# EAGLE design adruino robot rev (EAGLE 7.2.0)
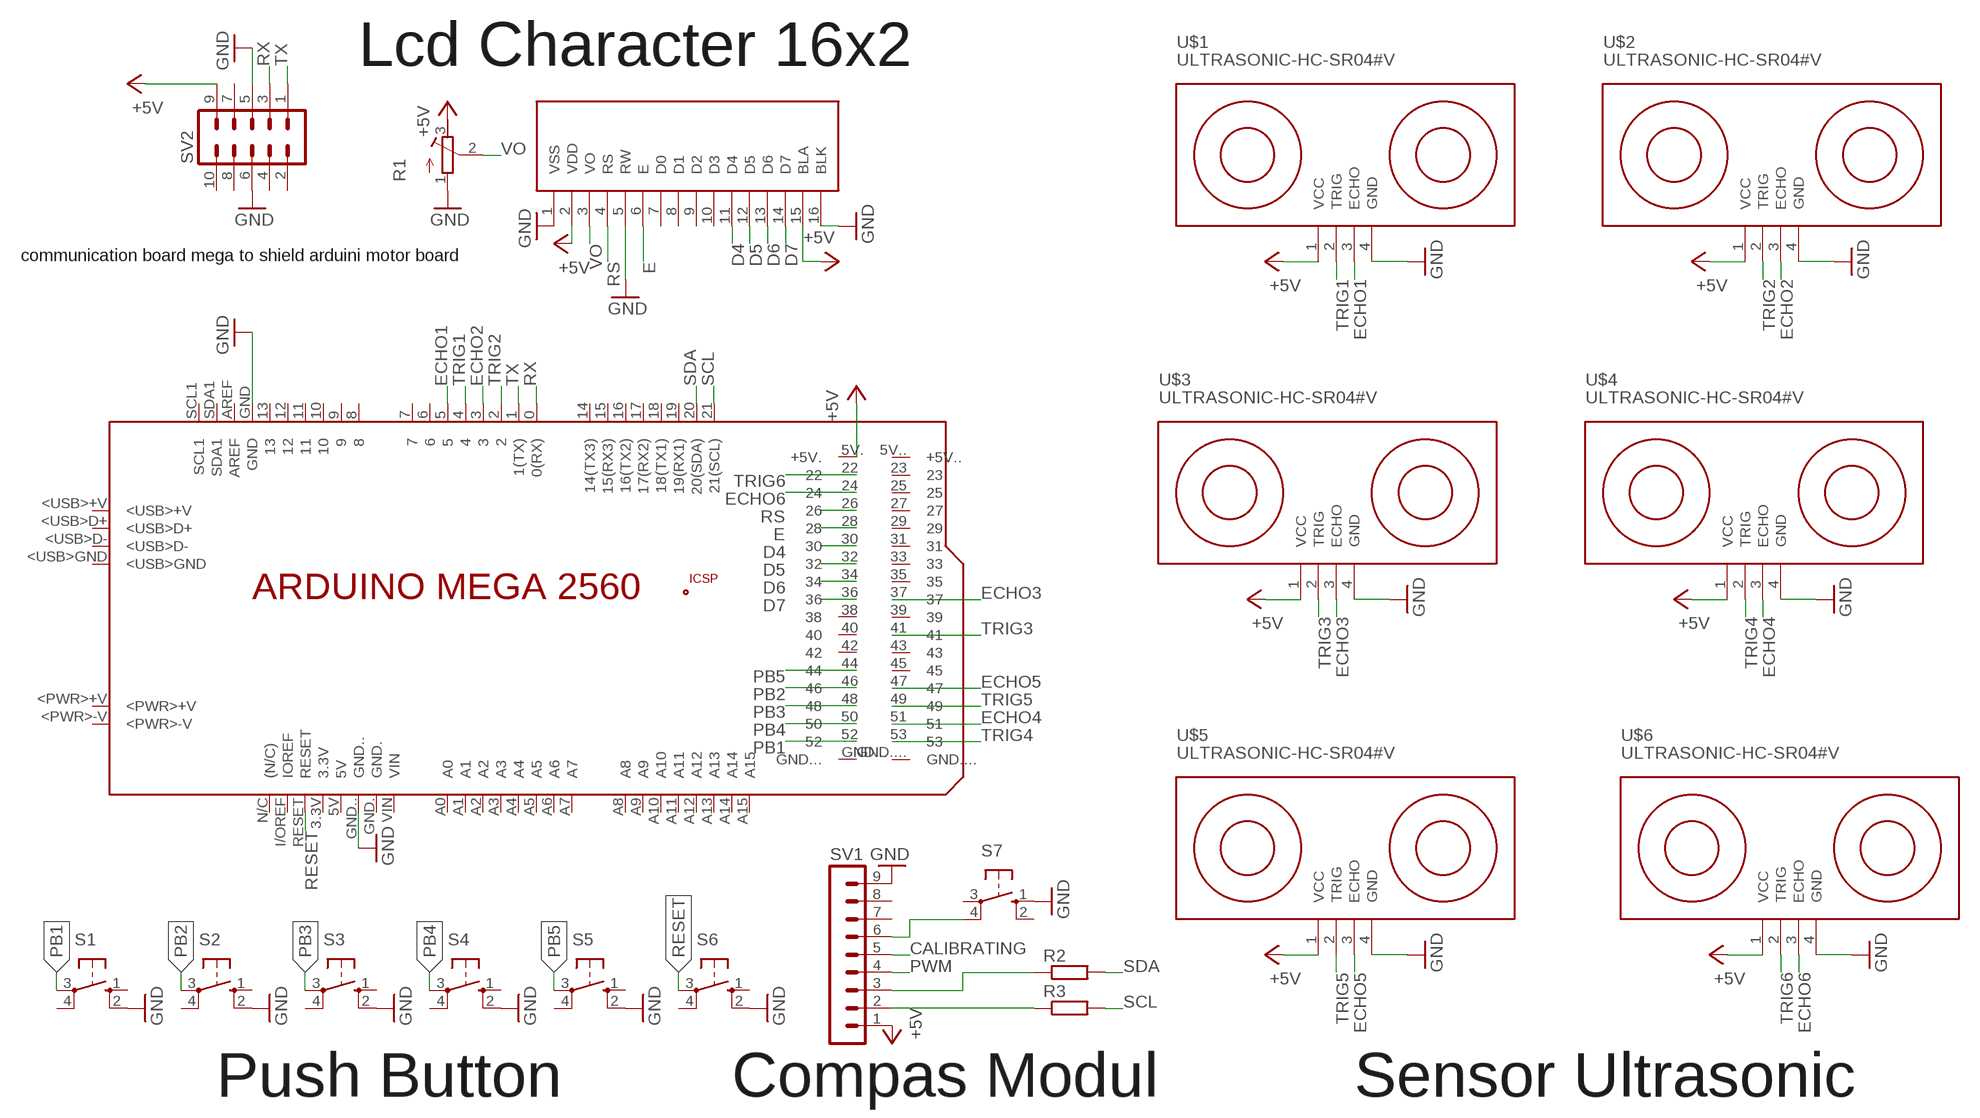
[diagram p0: schematic, sheet 1]

## Parts
PCB1  ARDUINO_MEGA2560  [ARDUINO_MEGA2560]
R1  R-TRIMM3339P  [RTRIM3339P]
R2  R-EU_0204/7  [0204/7]
R3  R-EU_0204/7  [0204/7]
S1  40-XX  [B3F-40XX]
S2  40-XX  [B3F-40XX]
S3  40-XX  [B3F-40XX]
S4  40-XX  [B3F-40XX]
S5  40-XX  [B3F-40XX]
S6  40-XX  [B3F-40XX]
S7  40-XX  [B3F-40XX]
SV1  MA09-1  [MA09-1]
SV2  ML10  [ML10]
U$1  ULTRASONIC-HC-SR04#V  [ULTRASONIC-HC-SR04#V]
U$2  ULTRASONIC-HC-SR04#V  [ULTRASONIC-HC-SR04#V]
U$3  ULTRASONIC-HC-SR04#V  [ULTRASONIC-HC-SR04#V]
U$4  ULTRASONIC-HC-SR04#V  [ULTRASONIC-HC-SR04#V]
U$5  ULTRASONIC-HC-SR04#V  [ULTRASONIC-HC-SR04#V]
U$6  ULTRASONIC-HC-SR04#V  [ULTRASONIC-HC-SR04#V]
U$7  2X16LCDTOP  [2X16LCDTOP]

## Nets
+5V: PCB1.5V.(+5V.) R1.3(E) SV1.1 SV2.9 U$1.1(VCC) U$2.1(VCC) U$3.1(VCC) U$4.1(VCC) U$5.1(VCC) U$6.1(VCC) U$7.2(VDD) U$7.15(BLA)
CALIBRATING: SV1.5
D4: PCB1.30 U$7.11(D4)
D5: PCB1.32 U$7.12(D5)
D6: PCB1.34 U$7.13(D6)
D7: PCB1.36 U$7.14(D7)
E: PCB1.28 U$7.6(E)
ECHO1: PCB1.5 U$1.3(ECHO)
ECHO2: PCB1.3 U$2.3(ECHO)
ECHO3: PCB1.37 U$3.3(ECHO)
ECHO4: PCB1.51 U$4.3(ECHO)
ECHO5: PCB1.47 U$5.3(ECHO)
ECHO6: PCB1.24 U$6.3(ECHO)
GND: PCB1.GND PCB1.GND.. R1.1(A) S1.2(S1) S2.2(S1) S3.2(S1) S4.2(S1) S5.2(S1) S6.2(S1) S7.1(S) SV1.9 SV2.5 SV2.6 U$1.4(GND) U$2.4(GND) U$3.4(GND) U$4.4(GND) U$5.4(GND) U$6.4(GND) U$7.1(VSS) U$7.5(RW) U$7.16(BLK)
N$2: R2.1 SV1.3
N$3: R3.1 SV1.2
N$7: S7.4(P1) SV1.6
PB1: PCB1.52 S1.3(P)
PB2: PCB1.46 S2.3(P)
PB3: PCB1.48 S3.3(P)
PB4: PCB1.50 S4.3(P)
PB5: PCB1.44 S5.3(P)
PWM: SV1.4
RESET: PCB1.RESET S6.3(P)
RS: PCB1.26 U$7.4(RS)
RX: PCB1.0(0(RX)) SV2.3
SCL: PCB1.21(21(SCL)) R3.2
SDA: PCB1.20(20(SDA)) R2.2
TRIG1: PCB1.4 U$1.2(TRIG)
TRIG2: PCB1.2 U$2.2(TRIG)
TRIG3: PCB1.41 U$3.2(TRIG)
TRIG4: PCB1.53 U$4.2(TRIG)
TRIG5: PCB1.49 U$5.2(TRIG)
TRIG6: PCB1.22 U$6.2(TRIG)
TX: PCB1.1(1(TX)) SV2.1
VO: R1.2(S) U$7.3(VO)
Unconnected: PCB1.3.3V PCB1.5V PCB1.5V..(+5V..) PCB1.6 PCB1.7 PCB1.8 PCB1.9 PCB1.10 PCB1.11 PCB1.12 PCB1.13 PCB1.14(14(TX3)) PCB1.15(15(RX3)) PCB1.16(16(TX2)) PCB1.17(17(RX2)) PCB1.18(18(TX1)) PCB1.19(19(RX1)) PCB1.23 PCB1.25 PCB1.27 PCB1.29 PCB1.31 PCB1.33 PCB1.35 PCB1.38 PCB1.39 PCB1.40 PCB1.42 PCB1.43 PCB1.45 PCB1.+5V_ PCB1.<PWR>+V PCB1.<PWR>-V PCB1.<USB>+V PCB1.<USB>D+ PCB1.<USB>D- PCB1.<USB>GND PCB1.A0 PCB1.A1 PCB1.A2 PCB1.A3 PCB1.A4 PCB1.A5 PCB1.A6 PCB1.A7 PCB1.A8 PCB1.A9 PCB1.A10 PCB1.A11 PCB1.A12 PCB1.A13 PCB1.A14 PCB1.A15 PCB1.AREF PCB1.GND. PCB1.GND... PCB1.GND.... PCB1.GND__ PCB1.I/OREF(IOREF) PCB1.MISO PCB1.MOSI PCB1.N/C((N/C)) PCB1.RESET. PCB1.SCK PCB1.SCL1 PCB1.SDA1 PCB1.VIN S1.1(S) S1.4(P1) S2.1(S) S2.4(P1) S3.1(S) S3.4(P1) S4.1(S) S4.4(P1) S5.1(S) S5.4(P1) S6.1(S) S6.4(P1) S7.2(S1) S7.3(P) SV1.7 SV1.8 SV2.2 SV2.4 SV2.7 SV2.8 SV2.10 U$7.7(D0) U$7.8(D1) U$7.9(D2) U$7.10(D3)

## Notes on the sheet
- Lcd Character 16x2
- communication board mega to shield arduini motor board
- Push Button | Compas Modul | Sensor Ultrasonic

## Library data of the parts
PCB1 = Arduino:ARDUINO_MEGA2560: Device for representing an Arduino Mega 2560 board with a footprint in an EAGLE design. Created by Dave Young for Element14. More EAGLE documentation at: http://www.element14.com/community/community/knode/cadsoft_eagle
R1 = resistor:R-TRIMM: Trimm resistor
R2 R3 = resistor:R-EU_: RESISTOR, European symbol
S1-S7 = switch-omron:40-XX: OMRON SWITCH; MF: OMRON COMPONENTS USA; MPN: B3F-4000; OC_FARNELL: 176434; OC_NEWARK: 36K3105
SV1 = con-lstb:MA09-1: PIN HEADER; OC_FARNELL: unknown; OC_NEWARK: unknown
SV2 = con-harting-ml:ML10: HARTING; OC_FARNELL: unknown; OC_NEWARK: unknown
U$1-U$6 = diy-modules:ULTRASONIC-HC-SR04: Ultrasonic Ranging Module HC-SR04 More details available here: http://randomnerdtutorials.com/complete-guide-for-ultrasonic-sensor-hc-sr04/ Click here to find device on ebay.com <http://www.ebay.com/sch/hc+sr04+ultrasonic>
U$7 = lcd_modules_ece:2X16LCDTOP

## Board
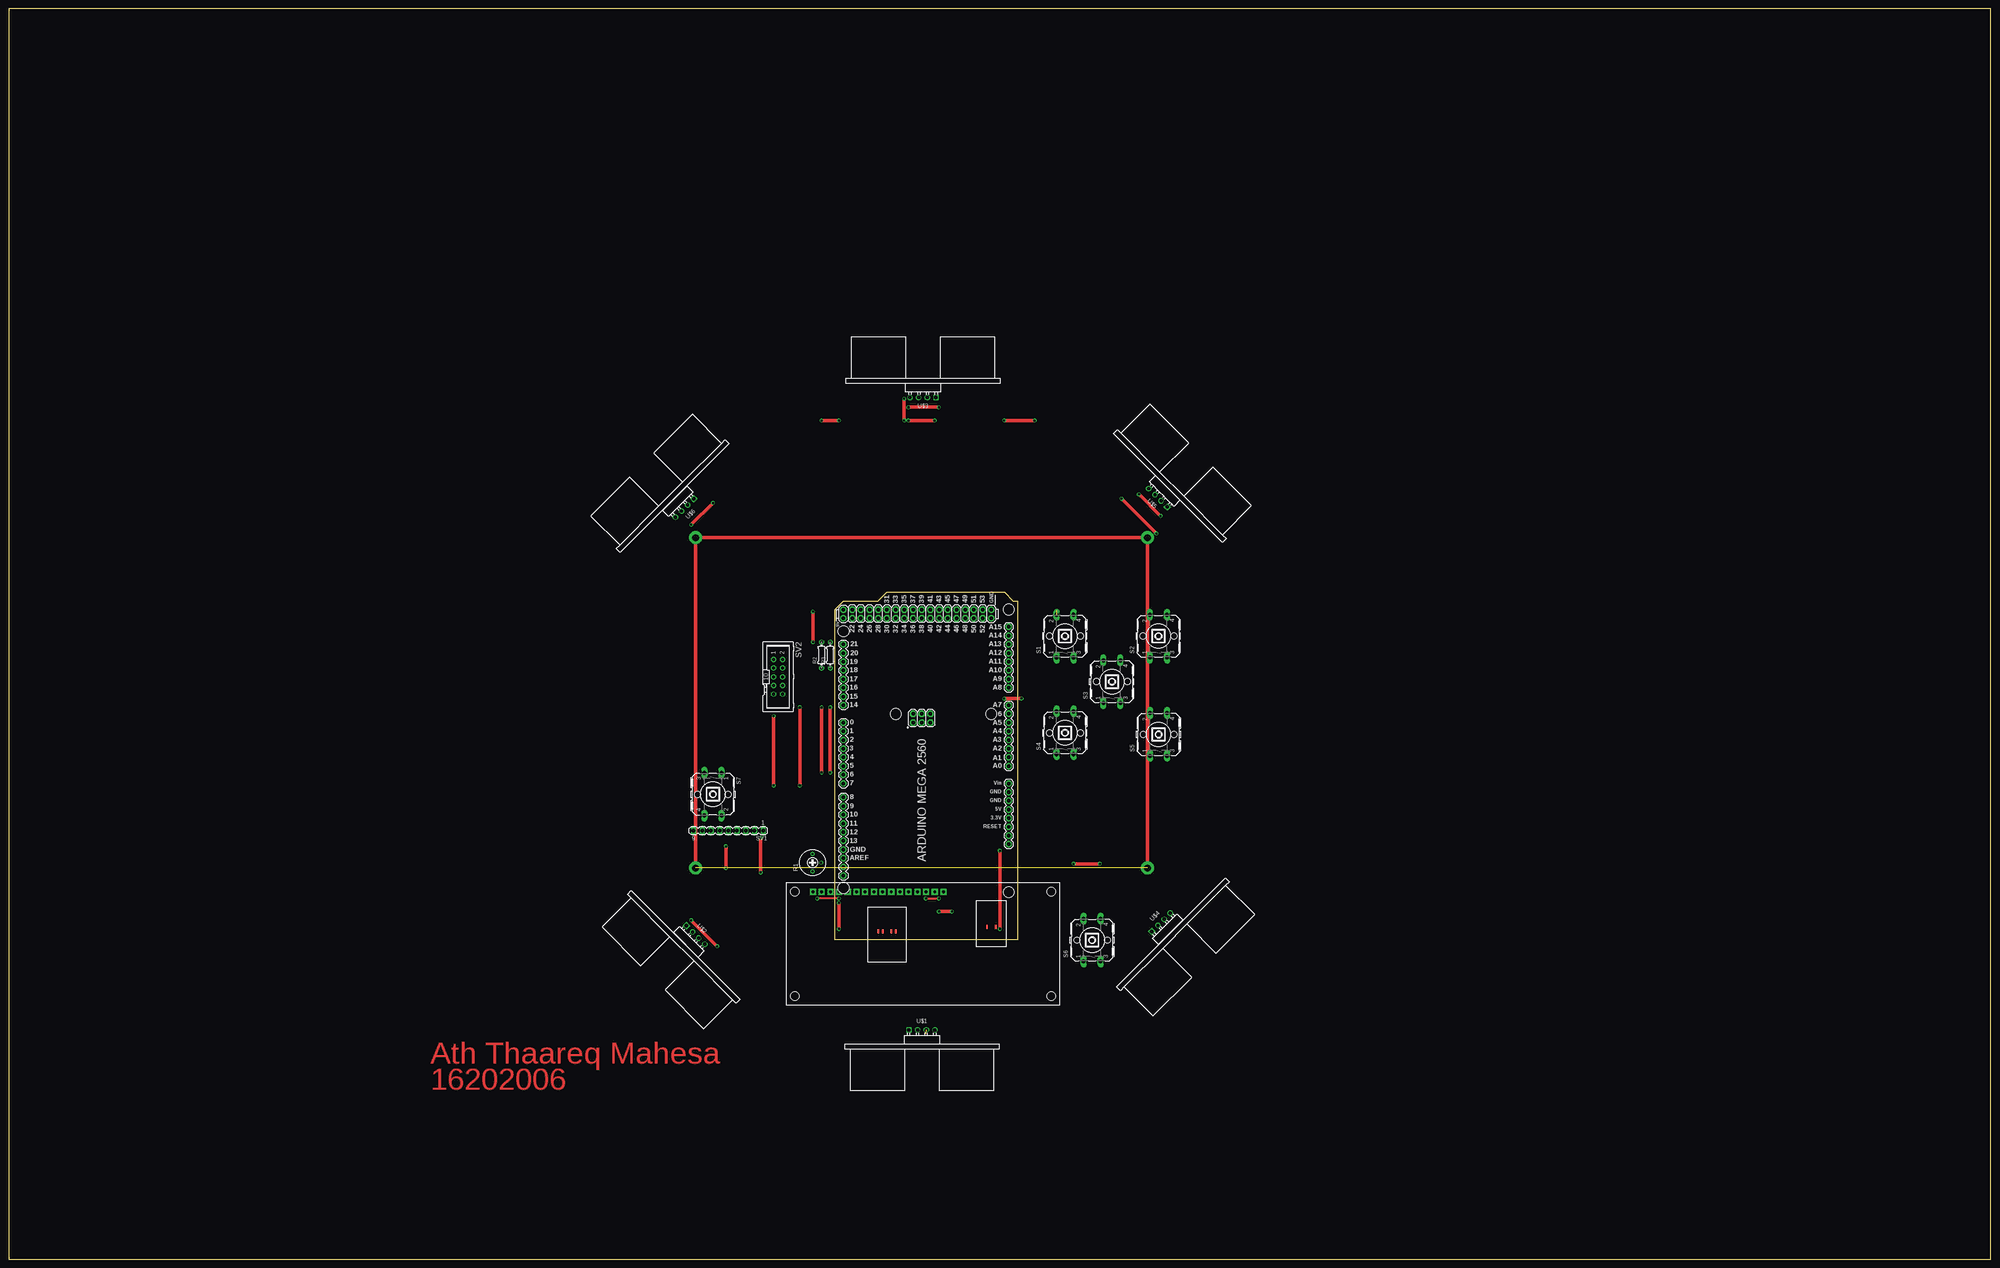
[diagram p1: board, top side]
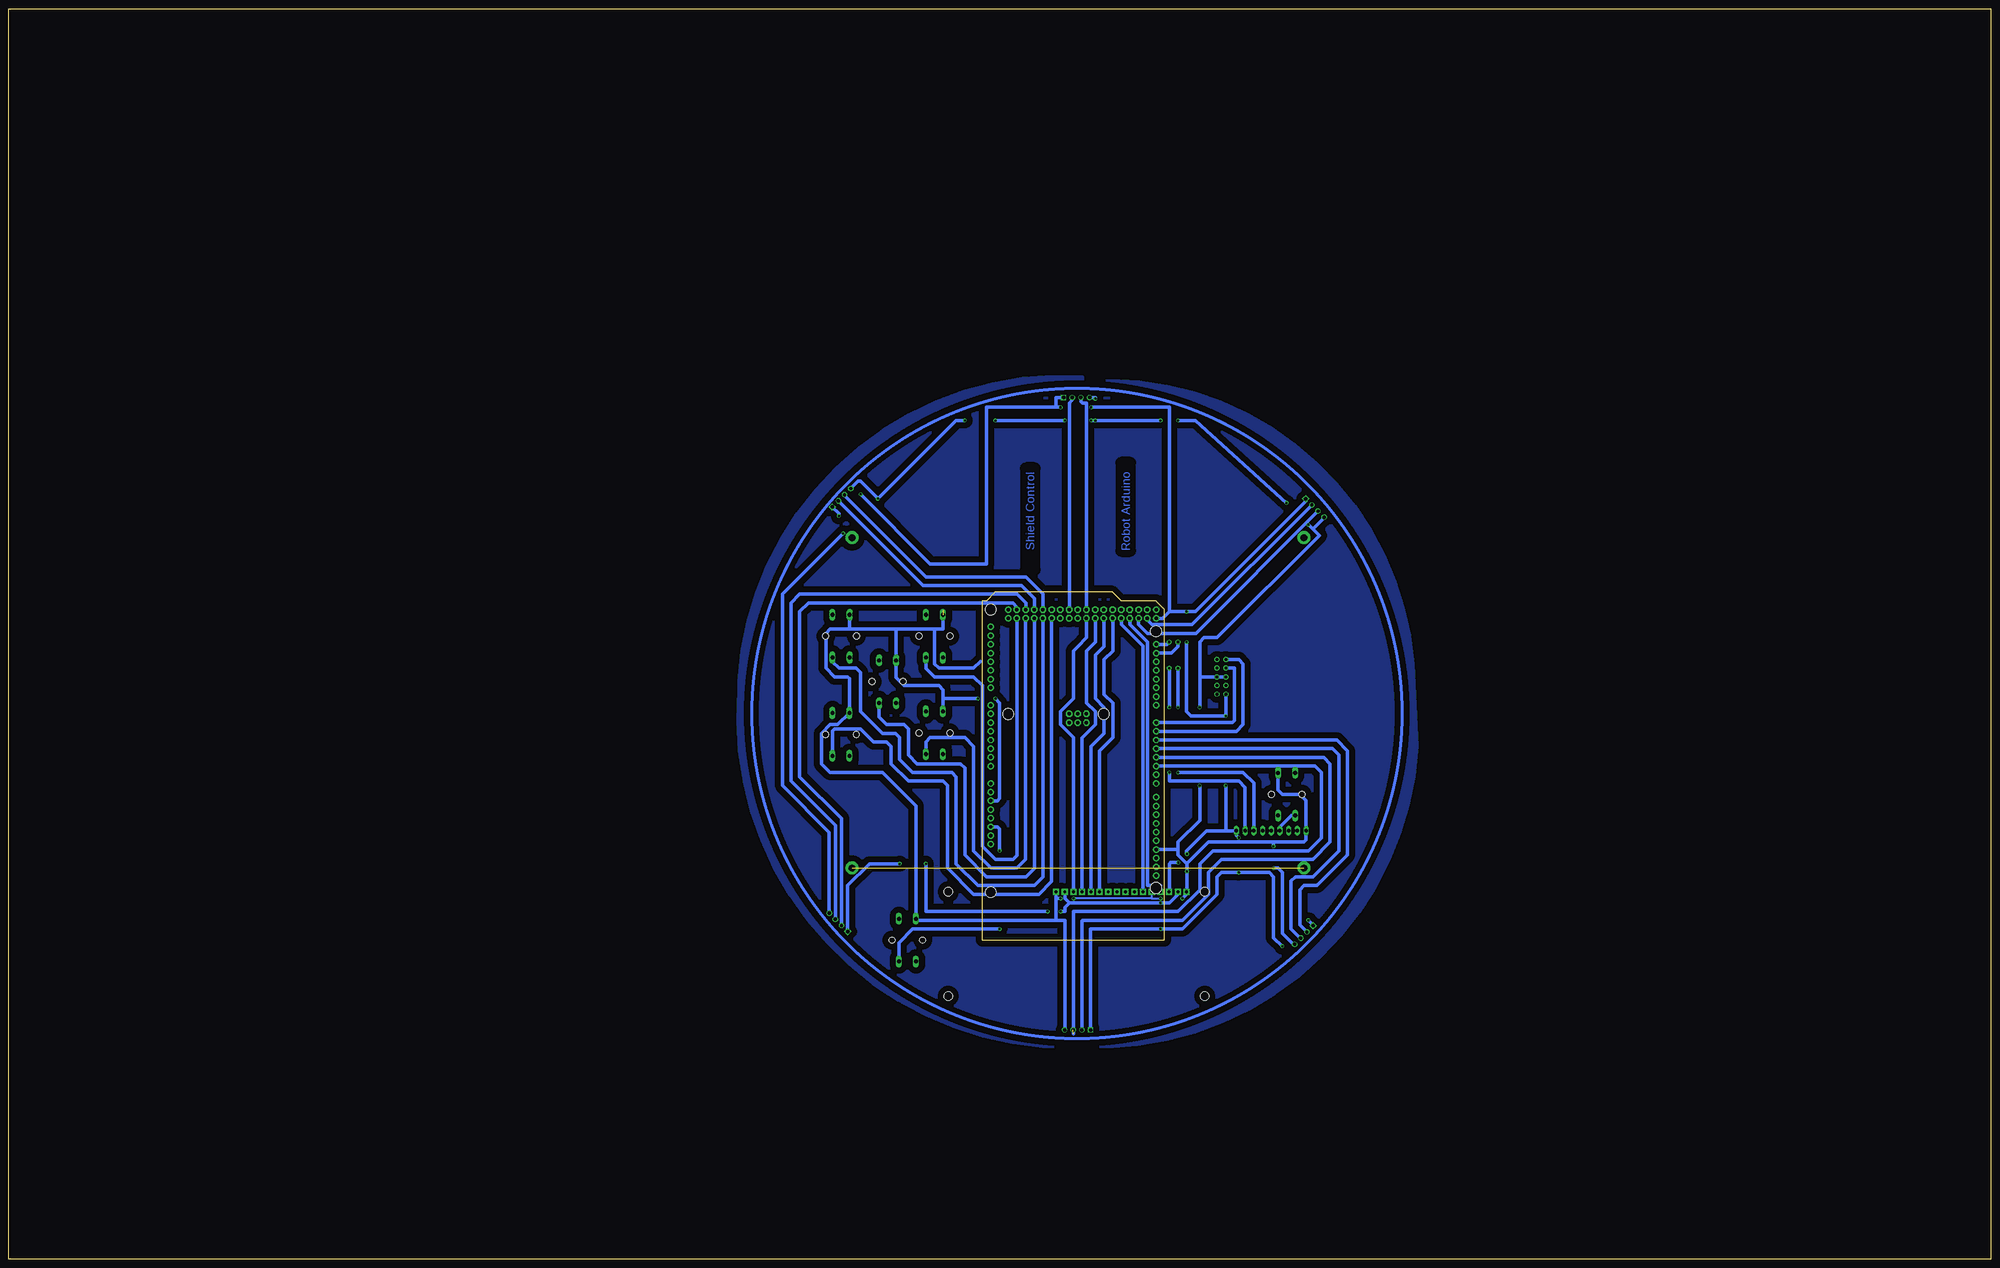
[diagram p2: board, bottom side, seen from below]

Size 579.1 x 365.43 mm. Coordinates in mm from the lower left corner, seen from the top.
Outline: 0,0 579.1,0 579.1,365.43 0,365.43 0,0
Copper layers (1*16): Top 0.035mm / dielectric 1.5mm / Bottom 0.035mm
Design rules "default": minimum track width 10mil, minimum drill 24mil, track to track 8mil, track to pad 8mil, pad to pad 8mil, via to via 8mil, smd to smd 8mil, copper to edge 40mil, drill to drill 8mil, minimum pad ring 10mil, minimum via ring 8mil, stop-mask expansion 4mil, vias tented up to drill 0mil, thermal gap 10mil

### Footprints (pad centres in the part's own frame; a part is rotated, then mirrored left to right if it is on the bottom)
ARDUINO_MEGA2560 = drill 1.016 pad 1.88: 0 63.5,50.8; 1 60.96,50.8; 2 58.42,50.8; 3 55.88,50.8; 3.3V 35.56,2.54; 4 53.34,50.8; 5 50.8,50.8; 5V 38.1,2.54; 5V. 93.98,50.8; 5V.. 96.52,50.8; 6 48.26,50.8; 7 45.72,50.8; 8 41.656,50.8; 9 39.116,50.8; 10 36.576,50.8; 11 34.036,50.8; 12 31.496,50.8; 13 28.956,50.8; 14 68.58,50.8; 15 71.12,50.8; 16 73.66,50.8; 17 76.2,50.8; 18 78.74,50.8; 19 81.28,50.8; 20 83.82,50.8; 21 86.36,50.8; A0 50.8,2.54; A1 53.34,2.54; A2 55.88,2.54; A3 58.42,2.54; A4 60.96,2.54; A5 63.5,2.54; A6 66.04,2.54; A7 68.58,2.54; A8 73.66,2.54; A9 76.2,2.54; A10 78.74,2.54; A11 81.28,2.54; A12 83.82,2.54; A13 86.36,2.54; A14 88.9,2.54; A15 91.44,2.54; AREF 23.876,50.8; GND 26.416,50.8; GND. 43.18,2.54; GND.. 40.64,2.54; GND... 93.98,7.62; GND.... 96.52,7.62; I/OREF 30.48,2.54; N/C 27.94,2.54; RESET 33.02,2.54; SCL1 18.796,50.8; SDA1 21.336,50.8; VIN 45.72,2.54 | drill 1.016 pad 1.88 octagon: 22 93.98,48.26; 23 96.52,48.26; 24 93.98,45.72; 25 96.52,45.72; 26 93.98,43.18; 27 96.52,43.18; 28 93.98,40.64; 29 96.52,40.64; 30 93.98,38.1; 31 96.52,38.1; 32 93.98,35.56; 33 96.52,35.56; 34 93.98,33.02; 35 96.52,33.02; 36 93.98,30.48; 37 96.52,30.48; 38 93.98,27.94; 39 96.52,27.94; 40 93.98,25.4; 41 96.52,25.4; 42 93.98,22.86; 43 96.52,22.86; 44 93.98,20.32; 45 96.52,20.32; 46 93.98,17.78; 47 96.52,17.78; 48 93.98,15.24; 49 96.52,15.24; 50 93.98,12.7; 51 96.52,12.7; 52 93.98,10.16; 53 96.52,10.16; +5V_ 66.04,30.48; GND__ 66.04,25.4; MISO 63.5,30.48; MOSI 66.04,27.94; RESET. 63.5,25.4; SCK 63.5,27.94 | smd 1.016 x 0.508: <PWR>+V 3.81,8.89; <PWR>-V 3.81,6.35; <USB>+V 2.54,40.64; <USB>D+ 2.54,39.37; <USB>D- 2.54,36.83; <USB>GND 2.54,35.56 | hole 3.2: 15.24,50.8; 13.97,2.54; 66.04,35.56; 66.04,7.62; 90.17,50.8; 96.52,2.54
RTRIM3339P = drill 0.61: 1 -2.54,0; 2 0,-2.54; 3 2.54,0
0204/7 = drill 0.813 octagon: 1 -3.81,0; 2 3.81,0
B3F-40XX = drill 1.194 long: 1 -6.248,2.489; 2 6.248,2.489; 3 -6.248,-2.489; 4 6.248,-2.489 | hole 1.803: 0,-4.496; 0,4.496
MA09-1 = drill 1.016 long: 1 -10.16,0; 2 -7.62,0; 3 -5.08,0; 4 -2.54,0; 5 0,0; 6 2.54,0; 7 5.08,0; 8 7.62,0; 9 10.16,0
ML10 = drill 0.914 octagon: 1 -5.08,-1.27; 2 -5.08,1.27; 3 -2.54,-1.27; 4 -2.54,1.27; 5 0,-1.27; 6 0,1.27; 7 2.54,-1.27; 8 2.54,1.27; 9 5.08,-1.27; 10 5.08,1.27
ULTRASONIC-HC-SR04#V = drill 1 square: 1 -3.81,0 | drill 1: 2 -1.27,0; 3 1.27,0; 4 3.81,0
2X16LCDTOP = drill 0.85 pad 1.778 square: 1 7.87,33.02; 2 10.41,33.02; 3 12.95,33.02; 4 15.49,33.02; 5 18.03,33.02; 6 20.57,33.02; 7 23.11,33.02; 8 25.65,33.02; 9 28.19,33.02; 10 30.73,33.02; 11 33.27,33.02; 12 35.81,33.02; 13 38.35,33.02; 14 40.89,33.02; 15 43.43,33.02; 16 45.97,33.02 | hole 2.54: 2.54,33.02; 77.47,33.02; 77.47,2.54; 2.54,2.54

### Placement (x,y rotation side)
PCB1  294.7,93.31 90 top
R1  234.87,115.89 90 top
R2  237.49,176.53 90 top
R3  240.03,176.53 90 top
S1  308.61,182.06 90 top
S2  335.91,182.07 90 top
S3  322.31,168.76 90 top
S4  308.62,153.84 90 top
S5  335.96,153.36 90 top
S6  316.54,93.25 90 top
S7  205.74,135.89 270 top
SV1  210.25,125.21 180 top
SV2  224.79,170.18 270 top
U$1  266.82,67.01 0 top
U$2  200.71,94.76 315 top
U$3  267.11,251.81 180 top
U$4  336.67,98.43 45 top
U$5  335.78,222.5 135 top
U$6  197.46,219.51 225 top
U$7  227.14,74.35 0 top

### Tracks (layer width: path | path; a pad name or v marks a point on that pad's centre or on a via)
+5V  (via drill 0.6)
  Top 1.016: v199.39,99.06 v207.01,91.44 | v219.71,113.03 v219.71,123.19 | v262.89,248.92 v271.78,248.92 | v330.2,223.52 v336.55,217.17 | v318.77,115.57 v311.15,115.57 | v275.59,101.6 v271.78,101.6 | v223.52,158.75 v223.52,138.43 | v242.57,96.52 v242.57,104.14 | v234.95,180.34 v234.95,189.23
  Bottom 1.016: U$7.15 270.56,105.47 269.24,104.14 | 269.24,104.14 v242.57,104.14 240.03,104.14 237.49,106.68 237.49,107.32 U$7.2 | R1.3 234.95,118.52 234.95,119.38 229.12,125.21 223.52,125.21 | U$2.1 198.01,97.68 v199.39,99.06 | v207.01,91.44 209.55,93.98 209.55,111.76 210.82,113.03 v219.71,113.03 224.79,113.03 226.06,111.76 226.06,106.68 236.22,96.52 v242.57,96.52 263.01,96.52 U$1.1 | U$6.1 200.16,221.48 232.41,189.23 v234.95,189.23 240.03,189.23 | 240.03,189.23 240.03,248.92 v262.89,248.92 | v271.78,248.92 273.05,248.92 | 273.05,248.92 293.37,248.92 293.37,203.2 309.88,203.2 v330.2,223.52 | v336.55,217.17 336.55,217.88 U$5.1 | v311.15,115.57 311.15,101.6 v275.59,101.6 | v271.78,101.6 270.51,101.6 270.51,102.87 269.24,104.14 | 223.52,125.21 SV1.1 220.41,123.9 v219.71,123.19 | PCB1.5V. 241.97,187.29 240.03,189.23 | v223.52,138.43 223.52,125.21 | SV2.9 v223.52,158.75 233.68,158.75 234.95,160.02 v234.95,180.34 | U$4.1 333.98,109.25 327.66,115.57 v318.77,115.57 | U$3.1 273.05,251.81 273.05,248.92
D4
  Bottom 1.016: U$7.11 260.4,148.54 256.54,152.4 256.54,162.56 259.08,165.1 259.08,175.26 256.54,177.8 256.54,187.23 PCB1.30
D5
  Bottom 1.016: U$7.12 262.94,149.81 259.08,153.67 259.08,161.29 261.62,163.83 261.62,176.53 259.08,179.07 259.08,187.23 PCB1.32
D6
  Bottom 1.016: U$7.13 265.49,152.34 261.62,156.21 261.62,160.02 264.16,162.56 264.16,177.8 261.62,180.34 261.62,187.23 PCB1.34
D7
  Bottom 1.016: U$7.14 268.02,152.45 271.78,156.21 271.78,160.02 267.97,163.83 267.97,177.8 266.7,179.07 264.16,181.61 264.16,187.23 PCB1.36
E
  Bottom 1.016: PCB1.28 254.06,185.48 247.7,179.12 U$7.6
ECHO1  (1 unrouted)
  Bottom 1.016: 267.97,65.86 267.97,101.6 237.49,101.6 231.14,107.95 231.14,115.57 227.33,119.38 199.39,119.38 195.58,123.19 195.58,142.24 197.45,144.11 PCB1.5
ECHO2
  Bottom 1.016: U$2.3 201.81,93.86 204.47,96.52 204.47,110.49 203.2,111.76 198.12,111.76 190.5,119.38 190.5,147.32 192.37,149.19 PCB1.3
ECHO3
  Bottom 1.016: PCB1.37 264.22,250.19 265.43,250.19 265.84,250.6 U$3.3
ECHO4
  Bottom 1.016: U$4.3 337.57,126.75 350.52,139.7 350.52,191.77 347.98,194.31 284.48,194.31 281.94,191.77 281.94,189.9 PCB1.51
ECHO5
  Bottom 1.016: U$5.3 334.88,223.12 311.15,199.39 281.94,199.39 276.92,194.37 PCB1.47
ECHO6
  Bottom 1.016: U$6.3 232.3,182.88 246.38,182.88 248.98,185.48 PCB1.24
GND  (via drill 0.6)  (1 unrouted)
  Top 0.61: v267.97,105.41 v271.78,105.41 | v242.57,105.41 v236.22,105.41
  Top 1.016: v335.28,212.09 v325.12,222.25 | v299.72,245.11 v290.83,245.11 | v270.51,245.11 v262.89,245.11 | v242.57,245.11 v237.49,245.11 | v261.62,251.46 v261.62,245.11 | v209.55,114.3 v209.55,120.65 | v205.74,220.98 v199.39,214.63 | v231.14,161.29 v231.14,138.43 | v290.83,163.83 v295.91,163.83
  Bottom 0.61: 245.11,105.41 v267.97,105.41 | U$7.5 245.16,105.47 245.11,105.41 | 245.11,105.41 v242.57,105.41 | 234.95,107.32 U$7.1
  Bottom 1.016: 333.43,184.15 339.09,184.15 340.36,182.88 340.36,172.72 337.82,170.18 334.01,170.18 333.47,169.64 S5.2 336.87,156.21 339.09,156.21 341.63,153.67 341.63,144.78 339.09,142.24 323.85,142.24 314.05,132.44 S6.2 314.05,99.06 273.05,99.06 | 333.43,184.15 S2.2 | 333.43,184.15 320.04,184.15 | 320.04,184.15 308.61,184.15 | 320.04,184.15 319.82,183.93 S3.2 319.82,169.96 317.5,167.64 307.34,167.64 306.07,166.37 306.07,163.83 | 308.61,184.15 308.61,173.99 307.34,172.72 297.18,172.72 295.24,174.66 | U$7.1 234.87,107.51 R1.1 234.87,115.65 | 306.07,163.83 306.07,160.14 S4.2 | 234.87,115.65 228.6,121.92 209.55,121.92 | U$5.4 330.95,227.33 330.2,227.33 v325.12,222.25 302.26,245.11 v299.72,245.11 | v290.83,245.11 v270.51,245.11 | v262.89,245.11 v261.62,245.11 v242.57,245.11 | U$3.4 261.62,251.81 v261.62,251.46 | v237.49,245.11 232.41,245.11 v205.74,220.98 | U$2.4 203.82,92.06 207.01,95.25 207.01,113.03 208.28,114.3 v209.55,114.3 | v209.55,120.65 209.55,121.92 | 234.95,107.32 234.95,106.68 v236.22,105.41 | 209.55,121.92 200.66,121.92 200.09,122.49 SV1.9 200.09,134.06 201.93,135.89 207.01,135.89 208.23,137.11 S7.1 | U$4.4 339.37,124.74 353.06,138.43 353.06,194.31 v335.28,212.09 | 231.14,170.18 231.14,180.34 229.87,181.61 226.06,181.61 196.21,211.46 198.12,213.36 | 231.14,170.18 v231.14,161.29 | v231.14,138.43 231.14,128.27 237.49,121.92 237.49,119.38 | PCB1.GND 237.84,119.73 237.49,119.38 | 234.87,115.65 235.03,115.65 237.49,118.11 237.49,119.38 | 306.07,189.52 306.07,184.15 308.61,184.15 | PCB1.GND.. 290.23,133.95 289.56,134.62 289.56,162.56 v290.83,163.83 | v295.91,163.83 306.07,163.83
  Bottom 1.016: SV2.5 SV2.6 231.14,170.18 | 198.12,213.36 v199.39,214.63 | 198.12,213.36 194.77,216.71 U$6.4 | U$1.4 270.51,67.01 270.51,99.06 273.05,99.06 | U$7.16 273.05,107.38 273.05,105.41 | 273.05,105.41 273.05,99.06 | v271.78,105.41 273.05,105.41
N$1
  pour Bottom (isolate 1.778): 167.64,149.86 168.91,173.99 arc-90 265.43,256.54 265.43,257.81 arc-90 365.76,168.91 365.76,166.37 arc-90 276.86,62.23 266.7,62.23 arc-90
N$2  (via drill 0.6)
  Top 1.016: v237.49,161.29 v237.49,142.24
  Bottom 1.016: R2.1 v237.49,161.29 | v237.49,142.24 218.44,142.24 215.33,139.13 SV1.3
N$3  (via drill 0.6)
  Top 1.016: v240.03,161.29 v240.03,142.24
  Bottom 1.016: R3.1 v240.03,161.29 | v240.03,142.24 240.03,139.7 219.71,139.7 217.88,137.87 SV1.2
N$4  (1 unrouted)
  Top 1.016: 200.66,114.43 200.66,210.69 | 332.74,114.43 332.74,210.69
N$5  (via drill 2 pad 3.81)
  other vias: 200.66,114.3
N$6  (via drill 2 pad 3.81)
  other vias: 332.74,114.3
N$7
  Bottom 1.016: SV1.6 207.71,126.3 204.37,129.64 S7.4
N$8  (via drill 2 pad 3.81)
  Top 1.016: v332.74,210.82 v200.66,210.82
PB1
  Bottom 1.016: S1.3 311.1,172.67 308.61,170.18 297.18,170.18 294.64,167.64 294.64,120.65 290.83,116.84 285.75,116.84 284.54,118.05 PCB1.52
PB2
  Bottom 1.016: S2.3 338.4,174.57 336.55,172.72 331.47,172.72 330.2,171.45 330.2,160.02 323.85,153.67 320.04,153.67 318.77,152.4 318.77,146.05 314.96,142.24 303.53,142.24 302.26,140.97 302.26,115.57 295.91,109.22 279.4,109.22 276.92,111.7 PCB1.46
PB3
  Bottom 1.016: S3.3 324.8,158.43 322.58,156.21 317.5,156.21 316.23,154.94 316.23,147.32 313.69,144.78 300.99,144.78 299.72,143.51 299.72,118.11 293.37,111.76 281.94,111.76 279.46,114.24 PCB1.48
PB4
  Bottom 1.016: S4.3 311.11,151.18 309.88,152.4 299.72,152.4 297.18,149.86 297.18,119.38 292.1,114.3 284.48,114.3 282,116.78 PCB1.50
PB5
  Bottom 1.016: S5.3 338.45,154.31 337.82,154.94 330.2,154.94 326.39,151.13 322.58,151.13 321.31,149.86 321.31,144.78 316.23,139.7 306.07,139.7 304.8,138.43 304.8,114.3 297.18,106.68 278.13,106.68 274.38,110.43 PCB1.44
RESET  (via drill 0.6)
  Top 1.016: v289.56,119.38 v289.56,96.52
  Bottom 1.016: S6.3 319.03,92.45 314.96,96.52 v289.56,96.52 | PCB1.RESET 290.16,126.33 289.56,125.73 v289.56,119.38
RS
  Bottom 1.016: U$7.4 242.62,109.22 246.38,109.22 246.38,180.34 251.46,185.42 251.46,187.23 PCB1.26
RX
  Bottom 1.016: PCB1.0 221.65,156.81 220.98,157.48 220.98,172.72 SV2.3
SCL
  Bottom 1.016: PCB1.21 240.7,179.67 R3.2
SDA
  Bottom 1.016: PCB1.20 239.43,177.13 237.49,179.07 R2.2
TRIG1
  Bottom 1.016: U$1.2 265.55,98.94 265.43,99.06 236.22,99.06 228.6,106.68 228.6,113.03 224.79,116.84 198.12,116.84 193.04,121.92 193.04,144.78 194.91,146.65 PCB1.4
TRIG2
  Bottom 1.016: U$2.2 201.93,97.78 201.93,107.95 200.66,109.22 196.85,109.22 187.96,118.11 187.96,148.59 191.1,151.73 PCB1.2
TRIG3
  Bottom 1.016: PCB1.41 269.24,189.83 269.24,250.19 268.38,251.05 U$3.2
TRIG4
  Bottom 1.016: U$4.2 335.77,128.76 347.98,140.97 347.98,189.23 345.44,191.77 285.75,191.77 284.48,190.5 284.48,189.9 PCB1.53
TRIG5
  Bottom 1.016: U$5.2 311.92,196.85 283.21,196.85 279.46,193.1 PCB1.49
TRIG6
  Bottom 1.016: U$6.2 233.35,185.42 245.11,185.42 246.44,186.75 PCB1.22
TX
  Bottom 1.016: PCB1.1 220.38,154.27 218.44,156.21 218.44,173.99 219.71,175.26 SV2.1
VO
  Bottom 1.016: R1.2 239.71,115.89 240.03,115.57 240.03,107.43 U$7.3
(copper drawn outside any net)
  shapes: Bottom circle x1

### Text on the board
Top: Ath Thaareq Mahesa | 16202006
Bottom: Shield Control | Robot Arduino